# Altium schematic sheet Sensor.SchDoc
size A
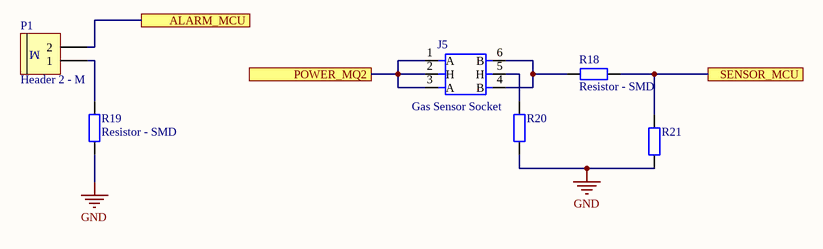
[diagram p0: Sensor.SchDoc]

## Parts
J5  Gas Sensor Socket  [MQ2]
P1  Header 2 - M  [Medium - Header 2]
R18  Resistor - SMD  [RES-SMD-0805]
R19  Resistor - SMD  [RES-SMD-0805]
R20  Resistor - SMD  [RES-SMD-0805]  (value not drawn)
R21  Resistor - SMD  [RES-SMD-0805]  (value not drawn)

## Ports
ALARM_MCU, POWER_MQ2, SENSOR_MCU

## Nets
GND: R19.2 R20.2 R21.2
ALARM_MCU: P1.2 ; port ALARM_MCU
POWER_MQ2: J5.1(A) J5.2(H) J5.3(A) ; port POWER_MQ2
SENSOR_MCU: R18.1 R21.1 ; port SENSOR_MCU
NetJ5_4: J5.4(B) J5.6(B) R18.2
NetJ5_5: J5.5(H) R20.1
NetP1_1: P1.1 R19.1

## Notes on the sheet
- (in symbol Header 2 - M) M

## Library data of the parts
J5 = MQ2
P1 = Header 2 - M: Header, 2-Pin, Medium; LatestRevisionDate: 17-Jul-2002; LatestRevisionNote: Re-released for DXP Platform.; Publisher: Altium Limited
R18-R21 = Resistor - SMD: Resistor SMD; Manufacturer: Generic Components; Class: Passive; Published: 08/06/2000; Publisher: Altium Hobart Technology Centre